# EAGLE design 14140^9 (EAGLE 7.6.0)
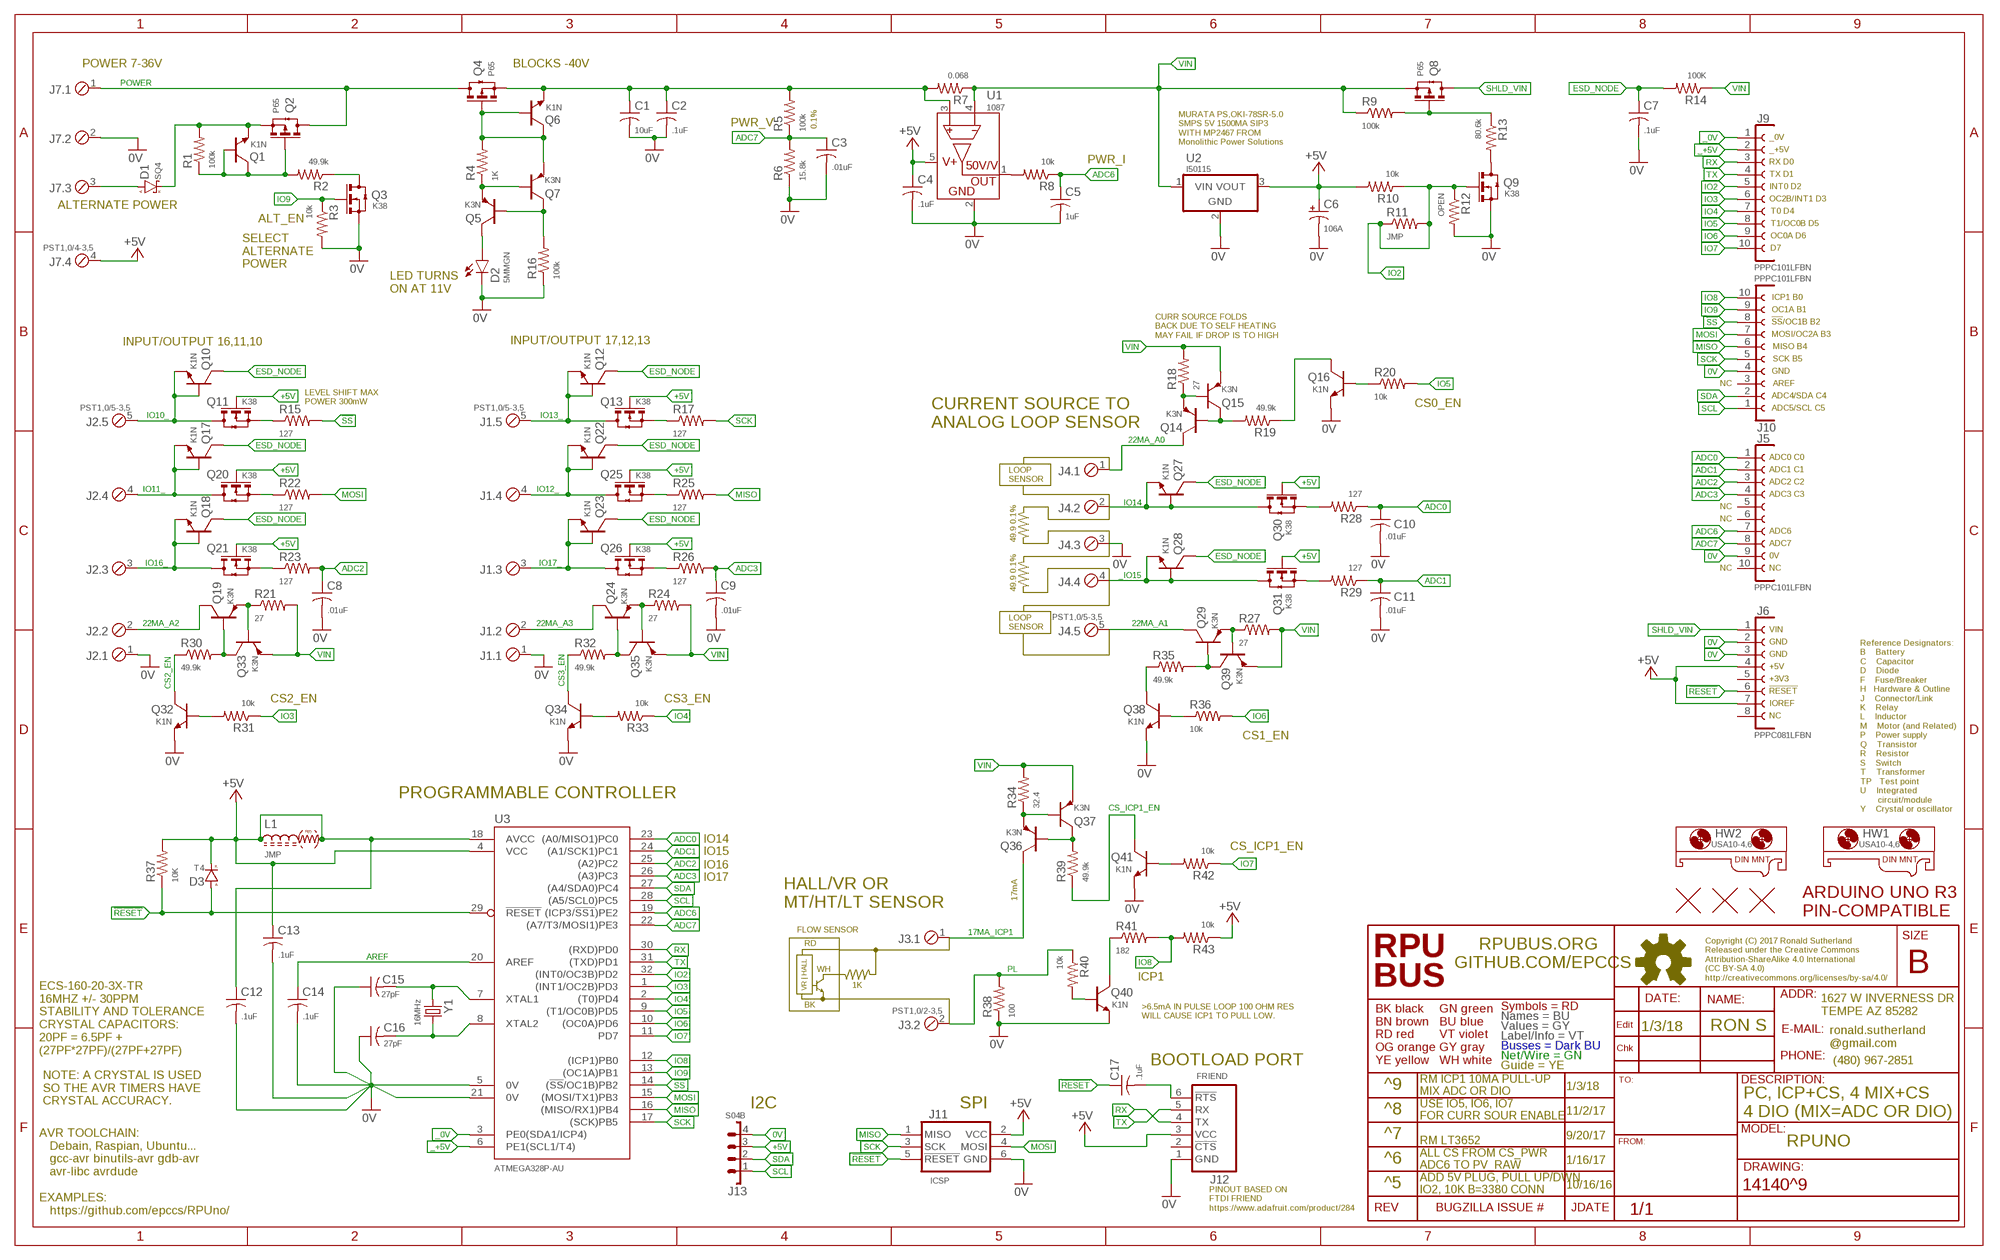
[diagram p0: schematic, sheet 1]

## Parts
C1  10uF  CC1206  [C1206(3216)]
C2  .1uF  CC0805A  [C0805(2012)]
C3  .01uF  CC0603A  [C0603(1608)]
C4  .1uF  CC0603A  [C0603(1608)]
C5  1uF  CC0805A  [C0805(2012)]
C6  106A  CT1206  [3216]
C7  .1uF  CC0603A  [C0603(1608)]
C8  .01uF  CC0603A  [C0603(1608)]
C9  .01uF  CC0603A  [C0603(1608)]
C10  .01uF  CC0603A  [C0603(1608)]
C11  .01uF  CC0603A  [C0603(1608)]
C12  .1uF  CC0603A  [C0603(1608)]
C13  .1uF  CC0603A  [C0603(1608)]
C14  .1uF  CC0603A  [C0603(1608)]
C15  27pF  CC0603A  [C0603(1608)]
C16  27pF  CC0603A  [C0603(1608)]
C17  .1uF  CC0603A  [C0603(1608)]
D1  SQ4  DSMA  [SMA]
D2  5MMGN  LED5MM  [LED5MM]
D3  T4  DSOD123  [SOD123]
HW1  USA10-4,6  MOUNT-HOLE5.0  [USA10]
HW2  USA10-4,6  MOUNT-HOLE5.0  [USA10]
J1  PST1,0/5-3,5  MCV5  [MCV5]
J2  PST1,0/5-3,5  MCV5  [MCV5]
J3  PST1,0/2-3,5  MCV2  [MCV2]
J4  PST1,0/5-3,5  MCV5  [MCV5]
J5  PPPC101LFBN  F1X10  [F1X10]
J6  PPPC081LFBN  F1X8  [F1X8]
J7  PST1,0/4-3,5  MCV4  [MCV4]
J9  PPPC101LFBN  F1X10  [F1X10]
J10  PPPC101LFBN  F1X10  [F1X10]
J11  ICSP  ISP-SPIPTH  [ISP]
J12  FRIEND  [FRIEND]
J13  S04B  B04B  [B04B]
L1  JMP  L0805  [C0805(2012)]
Q1  K1N  NPNSOT23  [SOT23]
Q2  P65  N-CHSOT23  [SOT23]
Q3  K38  N-CHSOT23  [SOT23]
Q4  P65  N-CHSOT23  [SOT23]
Q5  K3N  PNPSOT23  [SOT23]
Q6  K1N  NPNSOT23  [SOT23]
Q7  K3N  PNPSOT23  [SOT23]
Q8  P65  N-CHSOT23  [SOT23]
Q9  K38  N-CHSOT23  [SOT23]
Q10  K1N  NPNSOT23  [SOT23]
Q11  K38  N-CHSOT23  [SOT23]
Q12  K1N  NPNSOT23  [SOT23]
Q13  K38  N-CHSOT23  [SOT23]
Q14  K3N  PNPSOT23  [SOT23]
Q15  K3N  PNPSOT23  [SOT23]
Q16  K1N  NPNSOT23  [SOT23]
Q17  K1N  NPNSOT23  [SOT23]
Q18  K1N  NPNSOT23  [SOT23]
Q19  K3N  PNPSOT23  [SOT23]
Q20  K38  N-CHSOT23  [SOT23]
Q21  K38  N-CHSOT23  [SOT23]
Q22  K1N  NPNSOT23  [SOT23]
Q23  K1N  NPNSOT23  [SOT23]
Q24  K3N  PNPSOT23  [SOT23]
Q25  K38  N-CHSOT23  [SOT23]
Q26  K38  N-CHSOT23  [SOT23]
Q27  K1N  NPNSOT23  [SOT23]
Q28  K1N  NPNSOT23  [SOT23]
Q29  K3N  PNPSOT23  [SOT23]
Q30  K38  N-CHSOT23  [SOT23]
Q31  K38  N-CHSOT23  [SOT23]
Q32  K1N  NPNSOT23  [SOT23]
Q33  K3N  PNPSOT23  [SOT23]
Q34  K1N  NPNSOT23  [SOT23]
Q35  K3N  PNPSOT23  [SOT23]
Q36  K3N  PNPSOT23  [SOT23]
Q37  K3N  PNPSOT23  [SOT23]
Q38  K1N  NPNSOT23  [SOT23]
Q39  K3N  PNPSOT23  [SOT23]
Q40  K1N  NPNSOT23  [SOT23]
Q41  K1N  NPNSOT23  [SOT23]
R1  100k  R0805  [C0805(2012)]
R2  49.9k  R0805  [C0805(2012)]
R3  10k  R0805  [C0805(2012)]
R4  1K  R0805  [C0805(2012)]
R5  100k  R0805  [C0805(2012)]
R6  15.8k  R0805  [C0805(2012)]
R7  0.068  R1210  [C1210(3225)]
R8  10k  R0805  [C0805(2012)]
R9  100k  R0805  [C0805(2012)]
R10  10k  R0805  [C0805(2012)]
R11  JMP  R0805  [C0805(2012)]
R12  OPEN  R0805  [C0805(2012)]
R13  80.6k  R0805  [C0805(2012)]
R14  100K  R0805  [C0805(2012)]
R15  127  R0805  [C0805(2012)]
R16  100k  R0805  [C0805(2012)]
R17  127  R0805  [C0805(2012)]
R18  27  R0805  [C0805(2012)]
R19  49.9k  R0805  [C0805(2012)]
R20  10k  R0805  [C0805(2012)]
R21  27  R0805  [C0805(2012)]
R22  127  R0805  [C0805(2012)]
R23  127  R0805  [C0805(2012)]
R24  27  R0805  [C0805(2012)]
R25  127  R0805  [C0805(2012)]
R26  127  R0805  [C0805(2012)]
R27  27  R0805  [C0805(2012)]
R28  127  R0805  [C0805(2012)]
R29  127  R0805  [C0805(2012)]
R30  49.9k  R0805  [C0805(2012)]
R31  10k  R0805  [C0805(2012)]
R32  49.9k  R0805  [C0805(2012)]
R33  10k  R0805  [C0805(2012)]
R34  32.4  R0805  [C0805(2012)]
R35  49.9k  R0805  [C0805(2012)]
R36  10k  R0805  [C0805(2012)]
R37  10K  R0805  [C0805(2012)]
R38  100  R0805  [C0805(2012)]
R39  49.9k  R0805  [C0805(2012)]
R40  10k  R0805  [C0805(2012)]
R41  182  R0805  [C0805(2012)]
R42  10k  R0805  [C0805(2012)]
R43  10k  R0805  [C0805(2012)]
U1  1087  ZXCT1087  [SOT23-5]
U2  I50115  OKI-78SR-H  [OKI-78SR-H]
U3  ATMEGA328P-AU  ATMEGA328PB-AU  [TQFP32-08]
U$1  ARDUINO-UNO  [ARDUINO_UNO]
U$2  FIDUCIAL1.27  [FIDUCIAL-1.27]
U$3  FIDUCIAL1.27  [FIDUCIAL-1.27]
U$4  FIDUCIAL1.27  [FIDUCIAL-1.27]
Y1  16MHz  CSM-3X  [CSM-3X]

## Nets
0V: C1.2 C2.2 C3.2 C4.2 C5.2 C6.- C7.2 C8.2 C9.2 C10.2 C11.2 C12.2 C13.2 C14.2 C15.1 C16.1 D2.K J1.1 J2.1 J4.3 J5.9 J6.2 J6.3 J7.2 J10.4 J11.6(GND) J12.1(GND) J13.4 Q3.2(S)(S) Q9.2(S)(S) Q16.E Q32.E Q34.E Q38.E Q40.E Q41.E R3.2 R6.1 R12.2 R16.1 R38.1 U1.2(GND) U2.2(GND) U3.5(0V) U3.21(0V)
17MA_ICP1: J3.1 Q36.C
22MA_A0: J4.1 Q14.C
22MA_A1: J4.5 Q29.C
22MA_A2: J2.2 Q19.C
22MA_A3: J1.2 Q24.C
!RESET!: C17.1 D3.A J6.6 J11.5(!RESET) R37.1 U3.29(!RESET)
!SS: J10.8 R15.2 U3.14((!SS!/OC1B)PB2)
+5V: C4.1 C6.+ C12.1 C13.1 D3.C(K) J6.4 J6.7 J7.4 J11.2(VCC) J12.3(VCC) J13.3 L1.1 L1.2 Q11.1(G)(G) Q13.1(G)(G) Q20.1(G)(G) Q21.1(G)(G) Q25.1(G)(G) Q26.1(G)(G) Q30.1(G)(G) Q31.1(G)(G) R10.2 R37.2 R43.1 U1.5(VCC) U2.3(VOUT) U3.4(VCC) U3.18(AVCC)
_0V: J9.1 U3.3(PE0(SDA1/ICP4))
_+5V: J9.2 U3.6(PE1(SCL1/T4))
_IO14: J4.2 Q27.B Q27.E Q30.3(D)(D)
_IO15: J4.4 Q28.B Q28.E Q31.3(D)(D)
ADC0: C10.1 J5.1 R28.1 U3.23((A0/MISO1)PC0)
ADC1: C11.1 J5.2 R29.1 U3.24((A1/SCK1)PC1)
ADC2: C8.1 J5.3 R23.2 U3.25((A2)PC2)
ADC3: C9.1 J5.4 R26.2 U3.26((A3)PC3)
ADC6: C5.1 J5.7 R8.1 U3.19((ICP3/!SS1!)PE2)
ADC7: C3.1 J5.8 R5.1 R6.2 U3.22((A7/T3/MOSI1)PE3)
AREF: C14.1 U3.20(AREF)
CS2_EN: Q32.C R30.1
CS3_EN: Q34.C R32.1
CS_ICP1_EN: Q41.C R39.1
ESD_NODE: C7.1 Q10.C Q12.C Q17.C Q18.C Q22.C Q23.C Q27.C Q28.C R14.2
IO2: J9.5 Q9.1(G)(G) R10.1 R11.1 R11.2 R12.1 U3.32((INT0/OC3B)PD2)
IO3: J9.6 R31.1 U3.1((INT1/OC2B)PD3)
IO4: J9.7 R33.1 U3.2((T0)PD4)
IO5: J9.8 R20.2 U3.9((T1/OC0B)PD5)
IO6: J9.9 R36.2 U3.10((OC0A)PD6)
IO7: J9.10 R42.1 U3.11(PD7)
IO8: J10.10 R41.2 R43.2 U3.12((ICP1)PB0)
IO9: J10.9 Q3.1(G)(G) R3.1 U3.13((OC1A)PB1)
IO10_: J2.5 Q10.B Q10.E Q11.3(D)(D)
IO11_: J2.4 Q17.B Q17.E Q20.3(D)(D)
IO12_: J1.4 Q22.B Q22.E Q25.3(D)(D)
IO13_: J1.5 Q12.B Q12.E Q13.3(D)(D)
IO16_: J2.3 Q18.B Q18.E Q21.3(D)(D)
IO17_: J1.3 Q23.B Q23.E Q26.3(D)(D)
MISO: J10.6 J11.1(MISO) R25.2 U3.16((MISO/RX1)PB4)
MOSI: J10.7 J11.4(MOSI) R22.2 U3.15((MOSI/TX1)PB3)
N$1: Q25.2(S)(S) R25.1
N$2: Q8.1(G)(G) R9.2 R13.1
N$3: Q13.2(S)(S) R17.1
N$4: Q9.3(D)(D) R13.2
N$5: Q5.B Q7.C R16.2
N$6: Q4.1(G)(G) Q6.B Q6.C Q7.E R4.2
N$7: D2.A Q5.C
N$8: R8.2 U1.1(OUT)
N$9: Q24.E Q35.B R24.1
N$10: Q5.E Q7.B R4.1
N$11: Q24.B Q35.C R32.2
N$12: Q26.2(S)(S) R26.1
N$13: D1.A J7.3
N$15: Q31.2(S)(S) R29.2
N$16: Q30.2(S)(S) R28.2
N$18: Q41.B R42.2
N$19: Q38.C R35.1
N$20: Q14.E Q15.B R18.1
N$21: Q16.C R19.1
N$22: Q16.B R20.1
N$23: Q14.B Q15.C R19.2
N$25: Q38.B R36.1
N$26: Q32.B R31.2
N$28: Q29.E Q39.B R27.1
N$29: Q29.B Q39.C R35.2
N$30: Q34.B R33.2
N$32: D1.K Q1.E Q2.2(S)(S) R1.2
N$33: Q1.B Q1.C Q2.1(G)(G) R1.1 R2.2
N$34: Q3.3(D)(D) R2.1
N$35: C17.2 J12.6(!RTS)
N$91: Q19.E Q33.B R21.1
N$93: Q20.2(S)(S) R22.1
N$97: Q19.B Q33.C R30.2
N$104: Q11.2(S)(S) R15.1
N$107: Q40.B R40.2
N$108: Q40.C R41.1
N$110: Q21.2(S)(S) R23.1
N$114: Q36.E Q37.B R34.1
N$115: C15.2 U3.7(XTAL1) Y1.1
N$116: C16.2 U3.8(XTAL2) Y1.2
N$119: Q36.B Q37.C R39.2
PL: J3.2 R38.2 R40.1
POWER: J7.1 Q2.3(D)(D) Q4.3(D)(D)
RX: J9.3 J12.4(TX) U3.30((RXD)PD0)
SCK: J10.5 J11.3(SCK) R17.2 U3.17((SCK)PB5)
SCL: J10.1 J13.1 U3.28((A5/SCL0)PC5)
SDA: J10.2 J13.2 U3.27((A4/SDA0)PC4)
SHLD_VIN: J6.1 Q8.3(D)(D)
TX: J9.4 J12.5(RX) U3.31((TXD)PD1)
VIN: Q8.2(S)(S) Q15.E Q33.E Q35.E Q37.E Q39.E R7.1 R9.1 R14.1 R18.2 R21.2 R24.2 R27.2 R34.2 U1.4(S-) U2.1(VIN)
VIN_S: C1.1 C2.1 Q4.2(S)(S) Q6.E R5.2 R7.2 U1.3(S+)
Unconnected: J5.5 J5.6 J5.10 J6.5 J6.8 J10.3 J12.2(!CTS)

## Notes on the sheet
- POWER 7-36V | BLOCKS -40V
- PWR_V
- 0.1%
- _0V
- MURATA PS,OKI-78SR-5.0
  SMPS 5V 1500MA SIP3
  WITH MP2467 FROM 
  Monolithic Power Solutions
- _+5V
- PWR_I | RX D0
- TX D1
- INT0 D2
- OC2B/INT1 D3
- ALTERNATE POWER
- T0 D4
- ALT_EN
- T1/OC0B D5
- OC0A D6
- D7
- SELECT
  ALTERNATE
  POWER
- LED TURNS 
  ON AT 11V
- ICP1 B0
- OC1A B1
- !SS!/OC1B B2
- MOSI/OC2A B3
- CURR SOURCE FOLDS 
  BACK DUE TO SELF HEATING 
  MAY FAIL IF DROP IS TO HIGH
- INPUT/OUTPUT 16,11,10 | INPUT/OUTPUT 17,12,13
- MISO B4
- SCK B5
- GND
- NC | AREF
- ADC4/SDA C4
- LEVEL SHIFT MAX 
  POWER 300mW
- CS0_EN
- ADC5/SCL C5
- CURRENT SOURCE TO
  ANALOG LOOP SENSOR
- ADC0 C0
- ADC1 C1
- LOOP 
  SENSOR
- ADC2 C2
- ADC3 C3
- NC
- NC
- ADC6
- 49.9 0.1%
- ADC7
- 0V
- NC | NC
- 49.9 0.1%
- LOOP 
  SENSOR
- VIN
- GND
- GND
- +5V
- +3V3
- !RESET
- CS2_EN | CS3_EN
- IOREF
- NC
- CS1_EN
- PROGRAMMABLE CONTROLLER
- IO14
- CS_ICP1_EN
- IO15
- IO16
- IO17
- 17mA
- HALL/VR OR
  MT/HT/LT SENSOR
- FLOW SENSOR
- RD
- WH
- 1K | ICP1
- VR | HALL
- BK
- >6.5mA IN PULSE LOOP 100 OHM RES
  WILL CAUSE ICP1 TO PULL LOW.
- 1/3/18 | RON S
- ECS-160-20-3X-TR
  16MHZ +/- 30PPM
  STABILITY AND TOLERANCE
  CRYSTAL CAPACITORS:
  20PF = 6.5PF +
  (27PF*27PF)/(27PF+27PF)
- BOOTLOAD PORT
- ^9 | 1/3/18
- RM ICP1 10MA PULL-UP 
  MIX ADC OR DIO
- NOTE: A CRYSTAL IS USED 
  SO THE AVR TIMERS HAVE 
  CRYSTAL ACCURACY.
- I2C | SPI
- ^8 | 11/2/17
- PC, ICP+CS, 4 MIX+CS
  4 DIO (MIX=ADC OR DIO)
- USE IO5, IO6, IO7
  FOR CURR SOUR ENABLE
- ^7 | 9/20/17
- RM LT3652 | RPUNO
- ^6 | 1/16/17
- ALL CS FROM CS_PWR
  ADC6 TO PV_RAW
- ^5 | 10/16/16
- ADD 5V PLUG, PULL UP/DWN 
  IO2, 10K B=3380 CONN
- PINOUT BASED ON
  FTDI FRIEND
  https://www.adafruit.com/product/284
- AVR TOOLCHAIN: 
     Debain, Raspian, Ubuntu...
     gcc-avr binutils-avr gdb-avr 
     avr-libc avrdude
  
  EXAMPLES:
     https://github.com/epccs/RPUno/

## Library data of the parts
C1-C5 C7-C17 = C-C:C: CAPACITOR Symbol
C6 = C-T:CT: Tantalum Electrolytic Capacitor
D1 = D-SBR:D: DIODE
D2 = D-LED:LED: LED 120120WH [CREE,XHGAWT-00-0000-00000HXE1] LED WHITE 6500K 150LUM-W120120
D3 = D-GP:D: DIODE
HW1 HW2 = HW-DINMnt:MOUNT-HOLE: USA10-4.6 [PhxCont,1202713] DINRAIL ADAPTER UNIVERSAL 10MM 4.6MM
J1 J2 J4 = J-HDR3.5mm:MCV5: MCV 1,5/5-G-3,5-RN [PHOENIX CONTACT,1843635] CONN HEADER SHROUDED 5POS 3.5MM MCVR 1,5/5-ST-3,5 [PHOENIX CONTACT,1863181] CONN PLUG 5POS SCREW 3.5MM PST 1,0/5-3,5 [PHOENIX CONTACT,1945122] CONN HEADER STRIP PIN 5POS 3.5MM PT 1,5/5-PVH-3,5 [PHOENIX CONTACT,1984044] CONN PLUG STRIP 4POS 3.5MM Drill Size 3/64": .0469" (1.2mm)
J3 = J-HDR3.5mm:MCV2: MCV 1,5/ 2-G-3,5-RN [PHOENIX CONTACT,1731471] CONN HEADER SHROUDED 2POS 3.5MM MCVR 1,5/ 2-ST-3,5 [PHOENIX CONTACT,1863152] CONN PLUG 2POS SCREW 3.5MM PST 1,0/2-3,5 [PHOENIX CONTACT,1945096] CONN HEADER STRIP PIN 2POS 3.5MM PT1,5/2-PVH-3,5 [PHOENIX CONTACT,1984015] CONN PLUG STRIP 2POS 3.5MM
J5 J9 J10 = J-HDR2.54mm:F1X10: FEMALE HEADER 10POS
J6 = J-HDR2.54mm:F1X8: FEMALE HEADER 8POS
J7 = J-HDR3.5mm:MCV4: MCV 1,5/4-G-3,5-RN [PHOENIX CONTACT,1843622] CONN HEADER SHROUDED 2POS 3.5MM PST 1,0/4-3,5 [PHOENIX CONTACT,1945119] CONN HEADER STRIP PIN 4POS 3.5MM MCVR 1,5& 4-ST-3,5 [PHOENIX CONTACT,1863178] CONN PLUG 4POS SCREW 3.5MM
J11 = U-AVR:ISP-SPI: AVR ISP thru SPI In-System Programming uses the target Atmel AVR’s internal SPI (Serial Peripheral Interface) to download code into the flash and EEPROM memories. It is not a debugging interface. When designing an application PCB which includes an AVR with the SPI interface, this pinout should be used. Sparkfun SKU: BOB-08508
J12 = U-AVR:FRIEND: used for serial interfaces and serial bootloaders optiboot does not read the fuse but reports as they should be. It also erases chip. avrdude -c arduino -v -p atmega328p -P /dev/ttyUSB0 -b 115200 -U flash:w:BlinkLED.hex xboot use -e to erase chip, and -u to disable fuse checks since bootloaders can't see them. avrdude -c avr109 -v -p atmega1284p -P /dev/ttyUSB0 -b 115200 -e -u -U flash:w:BlinkLED.hex Arduino uses the nRTS (or nDTR) negative going edge to start the bootloader by causing a reset on the MCU.
J13 = J-HDR2mm:B04B: B04B [JST@B04B-PASK] CONN HEADER VERT THRU 4POS S04B [JST@S04B-PASK] CONN HEADER SIDE THRU 4POS
L1 = L-FB:L: Ferrite Bead with frequency dependent resistance
Q1 Q6 Q10 Q12 Q16-Q18 Q22 Q23 Q27 Q28 Q32 Q34 Q38 Q40 Q41 = Q-NPN:NPN: BJT NPN General Purpose Amplifier
Q2 Q4 Q8 = Q-PCH:N-CH?*: ENHANCEMENT MODE MOSFET SOT23 is BSS138 pinout
Q3 Q9 Q11 Q13 Q20 Q21 Q25 Q26 Q30 Q31 = Q-NCH:N-CH?*: ENHANCEMENT MODE MOSFET SOT23 is BSS138 pinout
Q5 Q7 Q14 Q15 Q19 Q24 Q29 Q33 Q35-Q37 Q39 = Q-PNP:PNP: BJT NPN General Purpose Amplifier
R1-R43 = R-C:R: Resiistor American-style symbol
U1 = U-Linear:ZXCT1087: 1087 [DIODES,ZXCT1087E5TA] HISIDE CURRENT MONITOR SOT23-5
U2 = P-DCDC:OKI-78SR: OKI-78SR OKI-78SR-5/1.5-W36H-C 5V@1.5A Horizontal Mount OKI-78SR-5/1.5-W36-C 5V@1.5A Vert Mount OKI-78SR-3.3/1.5-W36H-C 3.3V@1.5A Horizontal Mount OKI-78SR-3.3/1.5-W36-C 3.3V@1.5A Vert Mount Murata Power Solutions 7 to 36 VDC input range need to verify pinout
U3 = U-AVR:ATMEGA328PB-AU: ATmega328PB 4 Kbytes FLASH 128 bytes SRAM 256 bytes EEPROM 2 UART, 2 I2C, 2 SPI 8-channel 10 bit ADC
U$1 = J-BoardHDR:ARDUINO-UNO: Board Outline with holes and silk note the board dim layer is not defined
U$2-U$4 = H-Fiducial:FIDUCIAL: Fiducial Alignment Points Various fiducial points for machine vision alignment.
Y1 = Y-XTL:CSM: 16MHZ20 [ECS,ECS-160-20-3X-TR] CRYSTAL 16MHZ 20PF 30PPM CSM-3X

## Net classes
0 default: width 0.178 mm, drill 0.33 mm

## Board
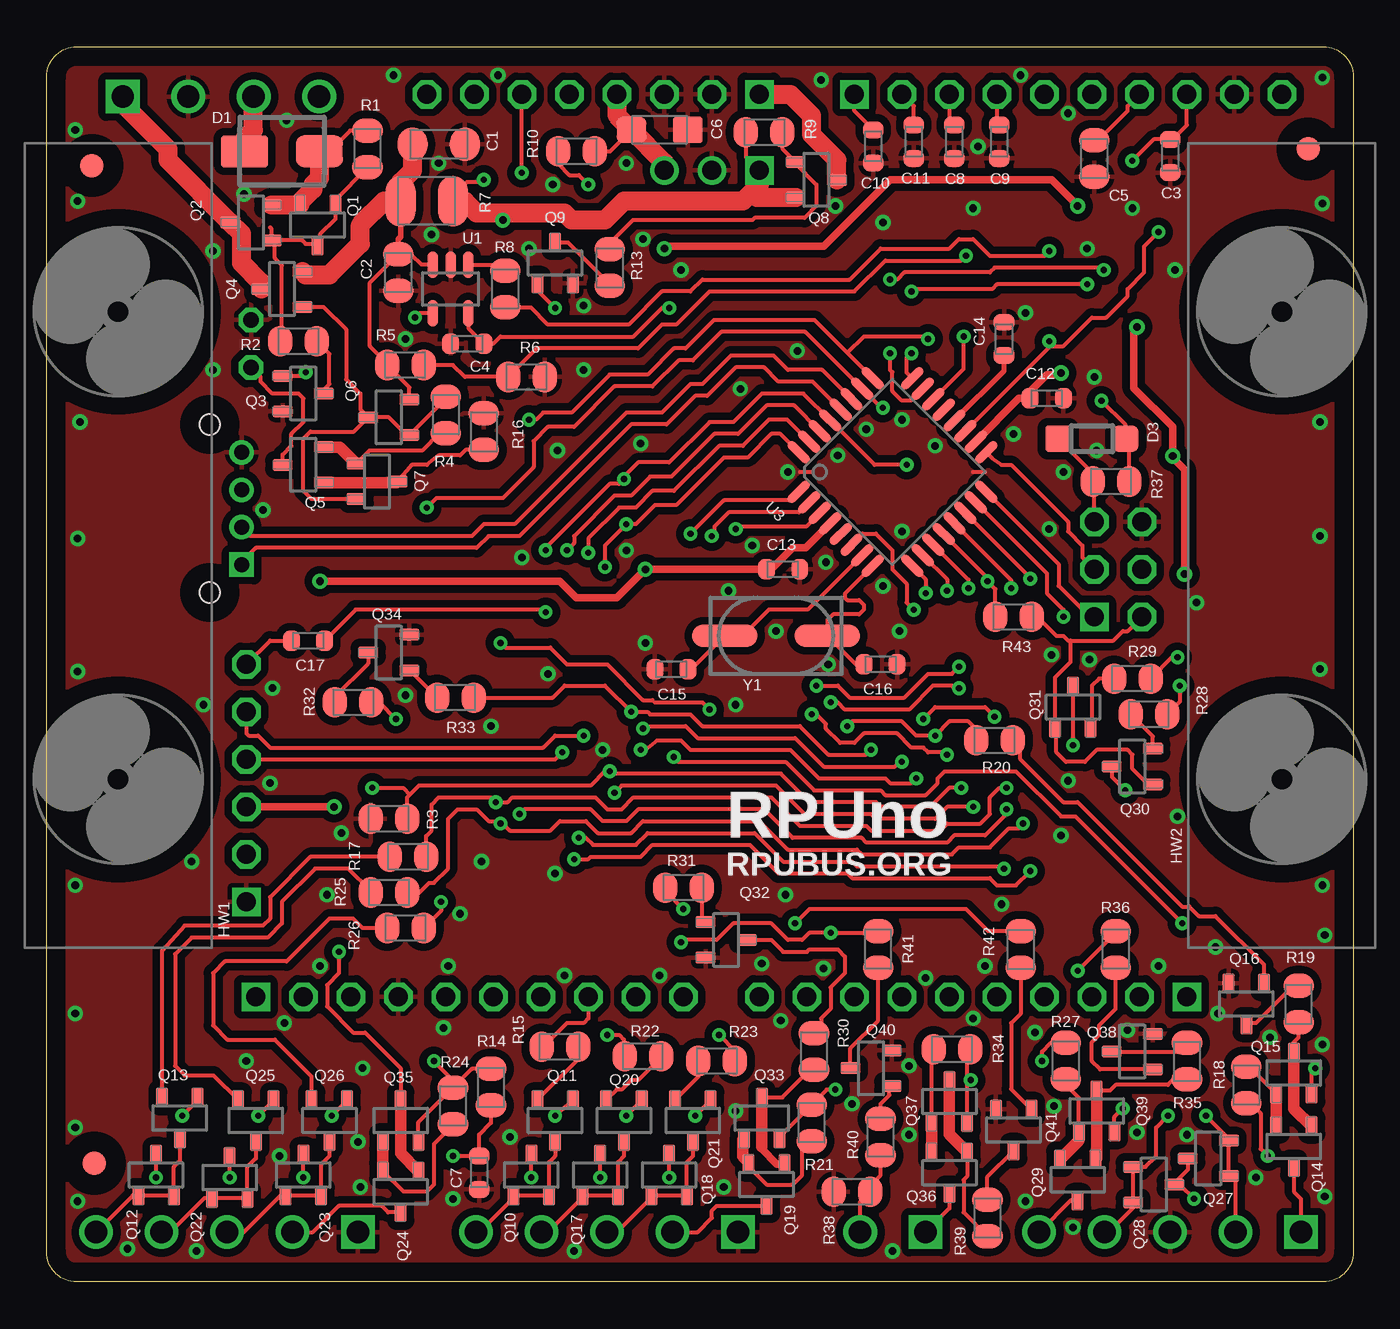
[diagram p1: board, top side]
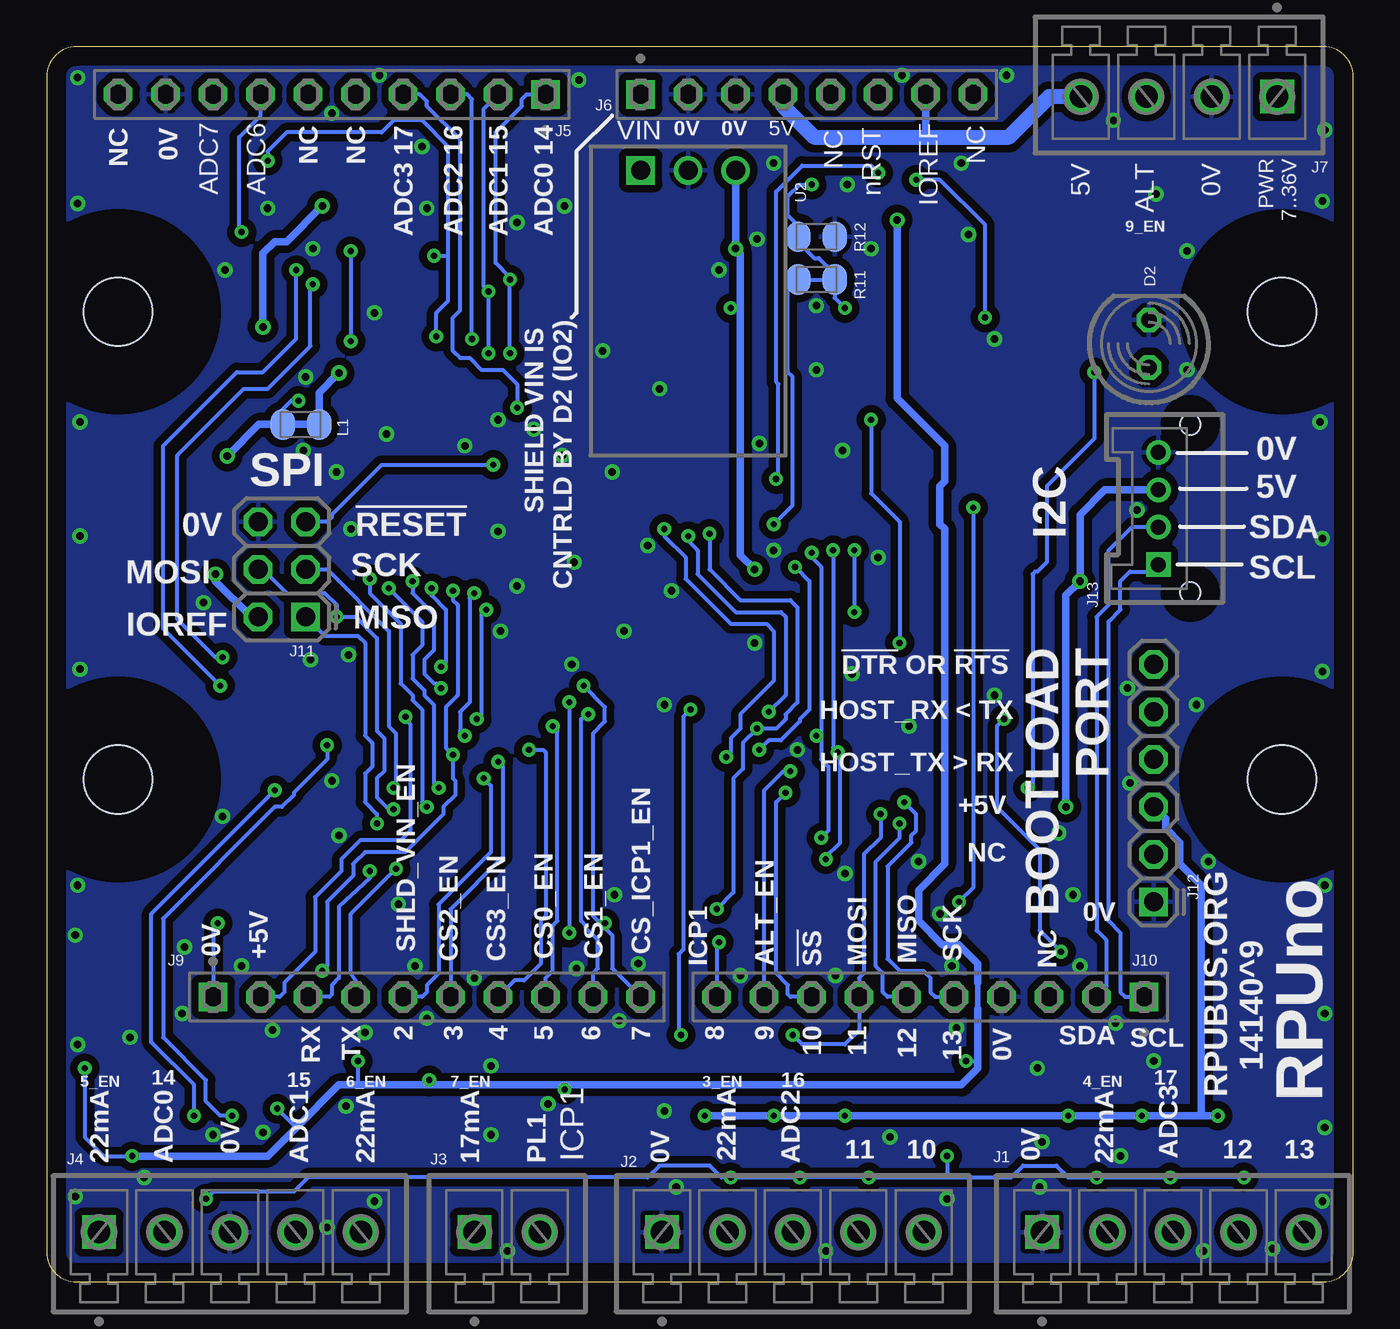
[diagram p2: board, bottom side, seen from below]

Size 69.85 x 66.04 mm. Coordinates in mm from the lower left corner, seen from the top.
Outline: 69.85,64.45 69.85,1.59 arc-90 68.26,0 1.59,0 arc-90 0,1.59 0,64.45 arc-90 1.59,66.04 68.26,66.04 arc-90 69.85,64.45
Copper layers (1*16): Top 0.034290625mm / dielectric 60mil / Bottom 0.034290625mm
Design rules "default *": minimum track width 7mil, minimum drill 13mil, track to track 12mil, track to pad 10mil, pad to pad 8mil, via to via 12mil, smd to smd 8mil, copper to edge 40mil, drill to drill 16mil, minimum pad ring 10mil, minimum via ring 8mil, stop-mask expansion 4mil, vias tented up to drill 17mil, thermal gap 10mil

### Footprints (pad centres in the part's own frame; a part is rotated, then mirrored left to right if it is on the bottom)
C1206(3216) = smd 1.6 x 1.8: 1 -1.4,0; 2 1.4,0
C0805(2012) = smd 1.321 x 1.651: 1 -0.977,0; 2 0.977,0
C0603(1608) = smd 0.898 x 1.1: 1 -0.889,0; 2 0.889,0
3216 = smd 1.6 x 1.4: + -1.5,0; - 1.5,0
SMA = smd 2.5 x 1.7: A 2,0; K -2,0
LED5MM = drill 0.813 octagon: A -1.27,0; K 1.27,0
SOD123 = smd 1.4 x 1.4: A 1.8,0; C -1.8,0
USA10 = hole 3.658: -12.5,0; 12.5,0
MCV5 = drill 1.2 square: 1 0,0 | drill 1.2: 2 3.5,0; 3 7,0; 4 10.5,0; 5 14,0
MCV2 = drill 1.2 square: 1 0,0 | drill 1.2: 2 3.5,0
F1X10 = drill 1.016 square: 1 0,0 | drill 1.016 octagon: 2 2.54,0; 3 5.08,0; 4 7.62,0; 5 10.16,0; 6 12.7,0; 7 15.24,0; 8 17.78,0; 9 20.32,0; 10 22.86,0
F1X8 = drill 1.016 square: 1 0,0 | drill 1.016 octagon: 2 2.54,0; 3 5.08,0; 4 7.62,0; 5 10.16,0; 6 12.7,0; 7 15.24,0; 8 17.78,0
MCV4 = drill 1.2 square: 1 0,0 | drill 1.2: 2 3.5,0; 3 7,0; 4 10.5,0
ISP = drill 1.016 square: 1 0,0 | drill 1.016 octagon: 2 0,2.54; 3 2.54,0; 4 2.54,2.54; 5 5.08,0; 6 5.08,2.54
FRIEND = drill 1.016 square: 1 0,0 | drill 1.016 octagon: 2 2.54,0; 3 5.08,0; 4 7.62,0; 5 10.16,0; 6 12.7,0
B04B = drill 0.8 square: 1 0,0 | drill 0.8: 2 2,0; 3 4,0; 4 6,0 | hole 1.1: 7.5,-1.7; -1.5,-1.7
SOT23 = smd 0.65 x 1.06: B -0.95,-1.1; C 0,1.1; E 0.95,-1.1
SOT23' = smd 0.65 x 1.06: 1(G) -0.95,-1.1; 2(S) 0.95,-1.1; 3(D) 0,1.1
C1210(3225) = smd 1.6 x 2.7: 1 -1.4,0; 2 1.4,0
SOT23-5 = smd 0.55 x 1.4: 1 -0.95,-1.3; 2 0,-1.3; 3 0.95,-1.3; 4 0.95,1.3; 5 -0.95,1.3
OKI-78SR-H = drill 1.016 square: 1 0,0 | drill 1.016: 2 -2.54,0; 3 -5.08,0
TQFP32-08 = smd 1.5 x 0.45: 1 -4.293,2.8; 2 -4.293,2; 3 -4.293,1.2; 4 -4.293,0.4; 5 -4.293,-0.4; 6 -4.293,-1.2; 7 -4.293,-2; 8 -4.293,-2.8; 17 4.293,-2.8; 18 4.293,-2; 19 4.293,-1.2; 20 4.293,-0.4; 21 4.293,0.4; 22 4.293,1.2; 23 4.293,2; 24 4.293,2.8 | smd 0.45 x 1.5: 9 -2.8,-4.293; 10 -2,-4.293; 11 -1.2,-4.293; 12 -0.4,-4.293; 13 0.4,-4.293; 14 1.2,-4.293; 15 2,-4.293; 16 2.8,-4.293; 25 2.8,4.293; 26 2,4.293; 27 1.2,4.293; 28 0.4,4.293; 29 -0.4,4.293; 30 -1.2,4.293; 31 -2,4.293; 32 -2.8,4.293
FIDUCIAL-1.27 = smd 1.27 x 1.27: 1 0,0
CSM-3X = smd 3.5 x 1.2: 1 -2.75,0; 2 2.75,0

### Placement (x,y rotation side)
C1  20.96,60.83 0 top
C2  18.8,53.98 270 top
C3  60.07,60.2 270 top
C4  22.48,50.16 180 top
C5  56.01,60.07 270 top
C6  32.77,61.59 0 top
C7  23.11,5.84 270 top
C8  48.51,60.96 270 top
C9  50.93,60.96 270 top
C10  44.2,60.71 270 top
C11  46.35,60.96 270 top
C12  53.47,47.24 0 top
C13  39.37,38.1 0 top
C14  51.18,50.42 90 top
C15  33.4,32.77 0 top
C16  44.58,33.02 180 top
C17  13.97,34.29 180 top
D1  12.57,60.45 180 top
D2  10.92,50.16 90 bottom
D3  55.88,45.09 180 top
HW1  3.81,39.37 90 top
HW2  66.04,39.37 90 top
J1  16.64,2.67 0 bottom
J2  36.96,2.67 0 bottom
J3  46.99,2.67 0 bottom
J4  67.06,2.67 0 bottom
J5  43.18,63.5 180 bottom
J6  38.1,63.5 0 bottom
J7  4.06,63.37 180 bottom
J9  60.96,15.24 0 bottom
J10  11.18,15.24 180 bottom
J11  56.01,35.56 90 bottom
J12  10.67,20.32 90 bottom
J13  10.41,38.35 90 bottom
L1  56.26,45.85 180 bottom
Q1  14.48,56.52 180 top
Q2  P65  [SOT23']  10.92,56.64 90 top
Q3  K38  [SOT23']  13.72,47.5 270 top
Q4  P65  [SOT23']  12.57,53.09 90 top
Q5  13.72,43.69 90 top
Q6  18.29,46.23 90 top
Q7  17.65,42.8 270 top
Q8  P65  [SOT23']  41.15,58.93 270 top
Q9  K38  [SOT23']  27.18,54.48 0 top
Q10  25.91,5.71 0 top
Q11  K38  [SOT23']  27.18,8.64 180 top
Q12  5.84,5.71 0 top
Q13  K38  [SOT23']  7.11,8.76 180 top
Q14  66.67,7.24 180 top
Q15  66.67,11.18 0 top
Q16  64.13,14.86 180 top
Q17  29.59,5.71 0 top
Q18  33.27,5.71 0 top
Q19  38.48,5.21 180 top
Q20  K38  [SOT23']  30.86,8.64 180 top
Q21  K38  [SOT23']  34.54,8.64 180 top
Q22  9.78,5.59 0 top
Q23  13.72,5.71 0 top
Q24  18.92,4.83 180 top
Q25  K38  [SOT23']  11.18,8.64 180 top
Q26  K38  [SOT23']  15.11,8.64 180 top
Q27  62.1,6.6 90 top
Q28  59.18,5.21 270 top
Q29  55.12,5.46 180 top
Q30  K38  [SOT23']  58.04,27.56 90 top
Q31  K38  [SOT23']  54.86,30.73 0 top
Q32  36.32,18.29 270 top
Q33  38.23,8.76 0 top
Q34  18.29,33.66 90 top
Q35  18.92,8.64 0 top
Q36  48.26,5.84 180 top
Q37  48.26,9.65 0 top
Q38  58.04,12.32 90 top
Q39  56.13,9.14 0 top
Q40  44.07,11.43 90 top
Q41  51.69,8.13 180 top
R1  17.14,60.58 90 top
R2  13.46,50.29 180 top
R3  18.29,24.77 180 top
R4  21.34,46.35 90 top
R5  19.18,49.02 180 top
R6  25.65,48.39 180 top
R7  20.32,57.78 180 top
R8  24.51,53.09 90 top
R9  38.35,61.47 0 top
R10  28.32,60.45 0 top
R11  28.7,53.59 0 bottom
R12  28.7,55.88 0 bottom
R13  30.1,54.23 270 top
R14  23.75,10.41 270 top
R15  27.43,12.57 180 top
R16  23.37,45.47 270 top
R17  19.3,22.73 0 top
R18  64.13,10.54 270 top
R19  66.93,14.86 270 top
R20  50.67,28.96 180 top
R21  40.89,8.51 90 top
R22  31.88,12.06 180 top
R23  35.81,11.81 0 top
R24  21.72,9.4 90 top
R25  18.29,20.83 0 top
R26  19.18,18.92 0 top
R27  54.48,11.81 90 top
R28  58.93,30.35 180 top
R29  58.04,32.26 180 top
R30  41.02,12.32 270 top
R31  34.04,21.08 0 top
R32  16.38,30.99 0 top
R33  21.84,31.24 180 top
R34  48.39,12.45 0 top
R35  60.96,11.81 270 top
R36  57.15,17.78 90 top
R37  56.9,42.8 0 top
R38  43.05,4.83 0 top
R39  50.29,3.43 270 top
R40  44.58,7.75 90 top
R41  44.45,17.78 90 top
R42  52.07,17.78 270 top
R43  51.69,35.56 180 top
U1  21.59,53.09 180 top
U2  38.1,59.44 180 bottom
U3  45.21,43.31 45 top
U$1  -7.62,66.04 180 bottom  (outside the outline)
U$2  67.44,60.58 0 top
U$3  2.41,59.69 0 top
U$4  2.54,6.35 0 top
Y1  38.99,34.54 0 top

### Tracks (layer width: path | path; a pad name or v marks a point on that pad's centre or on a via)
0V  (via drill 0.41)
  Top 0.203: 40.26,43.31 40.89,43.31 | 49.53,43.31 50.16,43.31
  other vias: 62.61,14.35 46.99,16.26 56.01,48.39 52.32,51.82 27.69,16.38 18.54,64.52 28.7,52.2 24.13,64.52 44.7,56.64 60.33,54.1 14.6,16.89 49.53,57.4 55.63,55.24 33.91,54.1 42.16,57.53 41.4,64.26 31.88,55.75 58.04,57.4 54.61,62.48 52.07,64.52 68.2,64.39 68.2,57.66 68.07,45.97 68.07,39.88 68.07,32.77 60.45,24.89 68.2,21.21 68.33,18.54 62.48,17.91 59.44,16.89 30.99,59.82 27.05,58.67 25.78,55.24 41.66,38.48 37.72,39.37 19.18,50.42 28.7,48.77 1.65,57.78 1.52,61.59 8.89,55.12 8.89,48.77 1.78,45.97 1.65,39.75 1.65,32.64 8.38,30.86 7.75,22.48 1.52,21.21 54.23,23.88 54.61,26.8 61.47,36.32 53.59,40.26 56.13,44.45 51.69,45.34 36.45,36.96 47.5,44.7 40.13,49.78 11.56,41.27 30.99,39.12 39.62,43.31 32.77,16.38 68.33,4.57 64.64,5.59 65.41,13.08 58.29,8 54.86,2.92 52.32,4.32 45.21,1.65 46.1,7.87 46.1,11.56 1.65,4.32 8,1.65 4.32,1.78 1.52,14.35 1.52,8.26 43.05,9.53 51.05,20.19 26.8,32.51 49.53,14.1 28.19,1.65 49.78,60.71 45.72,46.1 43.81,45.59 42.29,44.2 45.72,40.13 20.57,56.01 20.96,59.82 12.83,62.1 10.54,58.17 37.08,47.75 27.3,44.45 31.75,44.83 25.4,38.73 44.7,37.21 38.99,34.8 45.59,34.8 32,34.16 54.36,43.31 55.75,33.27 50.16,16.89 39.5,20.7 38.23,17.02 39.24,13.97 36.83,9.14 36.2,5.08 53.85,9.4 52.83,13.34 57.78,13.46 60.96,7.87 68.2,12.7 41.53,16.76 21.46,16.89 29.72,28.45 14.99,20.7 10.67,11.81 16.89,11.43 16.76,5.08 23.75,29.72 19.18,31.37 12.06,31.75 11.94,26.67 15.75,24 12.7,13.84 12.45,6.73 21.72,4.45 16.64,7.49 22.1,19.68 23.24,22.48 27.18,21.84 21.21,13.59 24.77,7.75 36.83,30.86 41.78,33.02 53.72,33.53
  pour Bottom (isolate 0.406): 0,66.04 69.85,66.04 69.85,0 0,0
  pour Top (isolate 0.406, rank 6): 0,66.04 69.85,66.04 69.85,0 0,0
17MA_ICP1
  Top 0.203: Q36.C 48.26,3.94 J3.1
22MA_A0
  Top 0.203: Q14.C 66.67,4.83 67.06,4.45 J4.1
22MA_A1
  Top 0.203: Q29.C 54.75,4.36 J4.5
22MA_A2
  Top 0.203: J2.2 34.8,2.67 35.56,3.43 35.56,3.81 35.81,4.06 38.44,4.06 Q19.C
22MA_A3
  Top 0.203: Q24.C 18.25,3.73 17.91,4.06 15.62,4.06 14.22,2.67 J1.2
!RESET!  (via drill 0.33)
  Top 0.203: v45.97,43.69 44.27,43.69 U3.29 40.45,47.5 38.23,47.5 36.7,45.97 35.43,45.97 33.27,43.81 31.62,43.81 30.86,43.05 v30.86,42.93 30.61,42.67 30.1,42.67 26.67,39.24 v26.67,39.12 | v25.4,59.31 J6.6 | J11.5 56.01,42.84 R37.1 55.92,43.25 D3.A | v26.67,35.81 26.54,35.94 16.51,35.94 C17.1
  Bottom 0.203: v45.97,43.69 51.94,43.69 54.61,41.02 54.61,40.89 54.86,40.64 J11.5 | v30.86,42.93 30.73,43.05 30.73,48.01 30.86,48.13 30.86,58.29 29.46,59.69 25.78,59.69 v25.4,59.31 | v26.67,39.12 v26.67,35.81
!SS  (via drill 0.33)
  Top 0.203: U3.14 52.58,37.64 v52.58,37.59 | v49.53,25.4 48.13,25.4 47.5,24.77 44.32,24.77 44.07,25.02 40.51,25.02 38.99,26.54 30.73,26.54 v30.35,26.16 | J10.8 28.96,14.1 28.7,13.84 27.81,13.84 26.92,12.95 26.67,12.66 R15.2
  Bottom 0.203: v52.58,37.59 52.58,36.83 50.93,35.18 50.93,32 50.29,31.37 50.29,31.11 49.78,30.61 49.78,25.65 v49.53,25.4 | J10.8 30.1,15.24 30.23,15.37 30.23,15.88 30.86,16.51 30.86,25.65 v30.35,26.16
+5V  (via drill 0.33, 0.41)
  Top 0.203: R10.2 30.12,60.45 C6.+ | R43.1 52.96,35.56 53.97,34.54 54.36,34.54 54.61,34.29 54.74,34.29 | 54.74,34.29 57.02,34.29 57.53,34.8 57.78,34.8 J11.2 | R37.2 57.87,44.89 D3.C 57.68,45.83 v56.39,47.12 | U1.5 22.54,50.99 C4.1 23.88,50.16 24.26,50.55 31.37,50.55 32.89,52.07 v33.27,52.07 | Q30.1(G) 58.86,26.61 58.04,27.43 58.04,28.19 57.78,28.45 56.13,28.45 55.5,27.81 54.48,27.81 53.97,28.32 53.97,29.57 Q31.1(G) 53.91,32.32 54.74,33.15 54.74,34.29 | Q11.1(G) 28.13,9.71 v27.18,8.89 | Q20.1(G) 31.81,9.71 v30.99,8.89 | Q21.1(G) 35.49,9.71 v34.67,8.89 | Q13.1(G) 8.06,9.71 v7.24,8.89 | Q25.1(G) 12.13,9.71 v11.3,8.89 | Q26.1(G) 16.06,9.71 v15.24,8.89
  Top 0.406: v55.12,57.53 53.72,58.93 45.09,58.93 41.53,55.37 33.15,55.37 v33.02,55.24 | U3.4 40.58,39.24 39.88,39.24 38.73,38.1 C13.1 v32,38.1 30.48,36.58 28.32,36.58 27.43,37.47 v14.6,37.47 | v60.83,37.85 60.83,43.43 60.2,44.07 v60.2,44.16 60.2,45.72 58.13,47.79 58.13,50.89 v58.29,51.05 | U3.18 51.98,47.24 C12.1 52.58,47.62 53.47,48.51 54.14,48.51 v54.23,48.6 | v15.37,25.4 J12.3
  Top 1.016: U2.3 33.02,59.84 C6.+ 30.48,62.38 J6.4
  Bottom 0.203: v56.39,47.12 56.77,47.12 57.24,46.65 L1.2 | v33.27,52.07 32.77,52.07
  Bottom 0.406: v32,38.1 32.77,38.86 32.77,52.07 32.77,54.99 v33.02,55.24 U2.3 | v55.12,57.53 57.02,55.63 57.66,55.63 58.29,54.99 v58.29,51.05 | J6.7 22.86,61.21 | v7.24,8.89 8.13,8.89 | 8.13,8.89 v11.3,8.89 v15.24,8.89 v27.18,8.89 v30.99,8.89 v34.67,8.89 | v60.83,37.85 60.83,37.47 58.93,35.56 J11.2 | v60.2,44.16 58.51,45.85 L1.2 L1.1 55.28,47.55 v54.23,48.6 | J13.3 13.27,42.35 14.6,41.02 v14.6,37.47 15.37,36.7 v15.37,25.4 | J12.3 10.03,24.77 10.03,24.26 9.27,23.5 9.27,22.35 8.13,21.21 8.13,8.89
  Bottom 0.813: J6.4 30.48,62.87 28.83,61.21 22.86,61.21 18.42,61.21 16.26,63.37 J7.4
_0V  (via drill 0.33)
  Top 0.203: U3.3 40.59,40.39 36.96,40.39 v36.83,40.26 | v33.53,28.07 33.78,27.81 39.5,27.81 41.02,26.29 44.58,26.29 44.83,26.04 46.99,26.04 47.62,26.67 47.62,26.92 48.01,27.3 51.82,27.3 54.23,24.89 54.99,24.89 v60.71,19.18
  Bottom 0.203: v60.71,19.18 60.96,19.18 J9.1 | v36.83,40.26 36.83,39.88 35.69,38.73 35.69,37.59 33.27,35.18 31.37,35.18 30.99,34.8 30.99,32.13 32.77,30.35 32.77,29.59 33.27,29.08 33.27,28.32 v33.53,28.07
_+5V  (via drill 0.33)
  Top 0.203: U3.6 43.61,40.01 44.32,40.01 45.21,39.12 45.21,38.1 45.97,37.34 45.97,36.32 v46.35,35.94 | v46.86,30.1 47.5,30.73 50.16,30.73 v50.67,30.23
  Bottom 0.203: J9.2 57.4,15.24 57.15,15.49 57.15,16 55.5,17.65 55.5,20.57 54.1,21.97 54.1,22.61 53.09,23.62 50.93,23.62 50.42,24.13 50.42,29.84 50.67,30.1 v50.67,30.23 | v46.35,35.94 46.61,35.69 46.61,30.35 v46.86,30.1
_IO14  (via drill 0.33)
  Top 0.203: J4.2 63.56,5.43 Q27.B Q27.E 63.31,7.55 v61.98,8.89 | v57.66,26.29 56.94,27.01 Q30.3(D)
  Bottom 0.203: v61.98,8.89 61.98,10.54 64.26,12.83 64.26,19.68 v57.66,26.29
_IO15  (via drill 0.33)
  Top 0.203: Q31.3(D) v54.86,28.7 | J4.4 56.77,2.67 58.08,3.98 Q28.E Q28.B 58.73,6.16 59.31,6.73 59.31,8.26 v59.94,8.89
  Bottom 0.203: v54.86,28.7 54.86,27.94 56.64,26.16 56.64,26.04 57.28,25.4 57.66,25.4 63.63,19.43 63.63,13.08 61.34,10.79 61.34,9.65 60.58,8.89 v59.94,8.89
ADC0  (via drill 0.33)
  Top 0.203: v56.52,54.1 56.39,54.23 50.67,54.23 50.42,53.98 45.85,53.98 45.47,53.59 v45.09,53.59 | C10.1 43.18,62.61 J5.1 | U3.23 46.19,47.12 45.72,47.12 45.21,47.62 45.21,48.64 45.09,48.77 v45.09,49.66 | v60.58,31.88 60.58,31.03 R28.1
  Bottom 0.203: v45.09,49.66 v45.09,53.59 45.09,53.72 45.85,54.48 45.85,61.47 44.45,62.87 44.45,63.25 44.2,63.5 J5.1 | v56.52,54.1 56.52,50.42 58.29,48.64 59.69,48.64 63.63,44.7 63.63,34.92 v60.58,31.88
ADC1  (via drill 0.33)
  Top 0.203: U3.24 45.97,48.62 45.97,49.4 v46.23,49.66 | v55.63,53.34 50.8,53.34 50.55,53.09 46.35,53.09 v46.23,52.96 | C11.1 46.35,62.87 J5.2 | v60.45,33.4 60.16,33.4 R29.1
  Bottom 0.203: v46.23,49.66 v46.23,52.96 46.48,53.21 46.48,62.74 J5.2 | v55.63,53.34 55.75,53.21 55.75,50.04 58.04,47.75 59.31,47.75 62.86,44.2 62.86,35.43 60.83,33.4 v60.45,33.4
ADC2  (via drill 0.33)
  Top 0.203: U3.25 42.81,49.67 | 42.81,49.67 41.04,51.44 35.69,51.44 34.16,49.91 33.53,49.91 32.13,48.51 30.1,48.51 28.07,46.48 26.54,46.48 26.16,46.1 v25.78,46.1 | v47.12,50.42 46.99,50.55 43.69,50.55 42.81,49.67 | J5.3 48.26,62.1 C8.1 | v24.26,34.16 24.51,33.91 26.92,33.91 27.81,33.02 29.97,33.02 31.88,31.11 32.38,31.11 32.51,30.99 35.05,30.99 v35.43,30.61 | v35.94,13.21 36.79,12.36 R23.2
  Bottom 0.203: v47.12,50.42 47.12,63.25 47.37,63.5 J5.3 | v25.78,46.1 25.78,42.16 24.26,40.64 v24.26,34.16 | v35.43,30.61 35.81,30.23 35.81,17.78 36.07,17.53 36.07,13.34 v35.94,13.21
ADC3  (via drill 0.33)
  Top 0.203: J5.4 50.8,61.98 C9.1 | v44.7,46.74 44.61,46.74 U3.26 40.55,50.8 36.07,50.8 34.54,49.28 33.78,49.28 32.38,47.88 30.35,47.88 28.19,45.72 26.8,45.72 26.04,44.96 26.04,43.56 24.38,41.91 20.83,41.91 v20.32,41.4 | v21.08,20.32 21.08,19.85 R26.2
  Bottom 0.203: J5.4 49.91,63.5 49.53,63.12 49.53,62.87 47.75,61.09 47.75,51.94 48.13,51.56 48.13,49.78 47.75,49.4 47.24,49.4 46.61,48.77 45.47,48.77 44.7,48.01 v44.7,46.74 | v20.32,41.4 20.32,21.08 v21.08,20.32
ADC6  (via drill 0.33)
  Top 0.203: U3.19 53.64,50.04 | 53.64,50.04 54.36,50.04 55.88,51.56 56.64,51.56 57.78,52.7 57.78,53.09 58.67,53.98 58.67,55.37 v59.44,56.13 | v53.59,55.12 53.34,54.86 50.42,54.86 49.53,55.75 48.77,55.75 48.26,55.24 44.58,55.24 42.93,53.59 35.05,53.59 34.42,52.96 32.89,52.96 31.11,51.18 26.8,51.18 25.87,52.11 R8.1 | 53.64,50.04 53.64,50.25 v53.59,50.29 | C5.1 56.22,61.05 57.78,62.61 57.78,62.87 J5.7
  Bottom 0.203: v59.44,56.13 59.56,56.26 59.56,61.21 58.42,62.36 J5.7 | v53.59,55.12 v53.59,50.29
ADC7  (via drill 0.33)
  Top 0.203: U3.22 49.02,48.81 v49.02,50.55 | v49.15,54.86 48.89,54.61 44.83,54.61 43.18,52.96 35.43,52.96 33.66,51.18 32.89,51.18 31.62,49.91 26.2,49.91 R6.2 22.35,48.39 21.72,49.02 R5.1 | J5.8 60.96,61.85 60.2,61.09 C3.1 59.18,61.09 v58.04,59.94
  Bottom 0.203: v49.02,50.55 49.02,51.82 48.39,52.45 48.39,54.86 | 48.39,54.86 48.39,60.71 49.78,62.1 51.31,62.1 51.94,61.47 57.02,61.47 58.04,60.45 v58.04,59.94 | v49.15,54.86 48.39,54.86
AREF
  Top 0.254: U3.20 51.18,48.71 C14.1
CS2_EN
  Top 0.203: Q32.C 38.73,18.29 39.37,17.65 40.64,17.65 40.77,17.78 42.29,17.78 42.67,17.4 42.67,16.51 41.91,15.75 41.91,14.61 41.4,14.1 41.4,13.68 R30.1
CS3_EN
  Top 0.203: R32.1 15.41,31.28 17.19,33.06 Q34.C
CS_ICP1_EN
  Top 0.203: R39.1 50.29,5.63 Q41.C
ESD_NODE  (via drill 0.33)
  Top 0.203: v61.34,4.45 60.58,5.21 Q28.C 60.28,5.29 61,6.01 Q27.C | v33.27,5.59 Q18.C | v29.59,5.59 Q17.C | v25.91,5.59 Q10.C | v5.84,5.59 Q12.C | v9.78,5.59 Q22.C | v13.72,5.59 Q23.C | v21.72,6.73 C7.1 23.11,7.87 23.75,8.51 R14.2
  Bottom 0.203: v5.84,5.59 v9.78,5.59 v13.72,5.59 15.24,5.59 15.87,6.22 17.65,6.22 18.29,5.59 21.72,5.59 | 21.72,5.59 v25.91,5.59 v29.59,5.59 v33.27,5.59 33.78,5.59 34.42,6.22 37.08,6.22 37.72,5.59 55.88,5.59 56.64,4.83 60.96,4.83 v61.34,4.45 | v21.72,6.73 21.72,5.59
IO2  (via drill 0.33)
  Top 0.203: R10.1 27.34,59.78 27.94,59.18 28.45,59.18 v28.96,58.67 | Q9.1(G) 26.23,53.02 v27.18,52.07 | U3.32 39.22,45.34 38.73,45.34 37.46,44.07 36.2,44.07 33.66,41.53 32.51,41.53 31.5,40.51 v30.99,40.51 29.85,39.37 v29.85,38.23 | v31.75,28.45 32,28.45 32.64,28.96 33.91,28.96 34.42,28.45 39.75,28.45 41.27,26.92 44.83,26.92 45.09,26.67 46.23,26.67 v46.48,26.92
  Bottom 0.203: v30.99,40.51 29.97,41.53 29.97,48.39 30.23,48.64 30.23,53.05 R11.1 R11.2 | R11.2 27.73,52.62 v27.18,52.07 | R11.2 27.81,53.68 27.81,53.98 28.57,54.74 28.83,54.74 29.68,55.59 R12.1 29.68,56.48 30.23,57.02 30.23,58.04 29.59,58.67 v28.96,58.67 | v29.85,38.23 29.08,37.47 29.08,30.61 29.59,30.1 29.59,29.97 30.61,28.96 31.24,28.96 v31.75,28.45 | v46.48,26.92 46.1,26.54 46.1,22.99 48.89,20.19 48.89,16.51 49.53,15.88 49.53,15.49 49.78,15.24 J9.5
IO3  (via drill 0.33)
  Top 0.203: 40.17,42.25 39.7,41.78 36.2,41.78 v34.42,40.01 | v31.88,29.59 32.13,29.72 34.16,29.72 34.8,29.08 40,29.08 41.53,27.56 45.34,27.56 45.59,27.81 v45.72,27.81 | R31.1 33.06,20.92 v34.04,19.94
  Top 0.254: U3.1 40.17,42.25
  Bottom 0.203: v34.42,40.01 34.42,38.1 32.77,36.45 30.1,36.45 29.72,36.07 29.72,30.99 30.35,30.35 30.35,30.1 30.86,29.59 v31.88,29.59 32.64,28.83 32.64,27.43 33.15,26.92 33.15,20.83 v34.04,19.94 | v45.72,27.81 45.47,27.56 45.47,22.73 48.26,19.94 J9.6
IO4  (via drill 0.33)
  Top 0.203: U3.2 40.22,41.15 36.45,41.15 35.69,40.39 35.69,40.01 v35.56,39.88 | v44.07,28.45 43.81,28.19 41.78,28.19 40.26,29.72 35.05,29.72 34.42,30.35 32.26,30.35 32.13,30.48 v31.24,30.48 29.85,31.88 27.69,31.88 27.05,31.24 R33.1
  Bottom 0.203: v44.07,28.45 43.31,28.45 43.18,28.32 43.18,19.56 43.43,19.3 43.43,17.02 44.32,16.13 44.83,16.13 J9.7 | v35.56,39.88 35.56,39.62 35.05,39.12 35.05,37.85 33.02,35.81 30.61,35.81 30.35,35.56 30.35,31.37 v31.24,30.48
IO5  (via drill 0.33)
  Top 0.203: U3.9 46.99,37.57 v46.99,36.83 | v42.8,29.72 43.05,29.97 45.72,29.97 46.48,29.21 v47.5,29.21 48.26,29.97 49.28,29.97 49.66,29.59 R20.2
  Bottom 0.203: v46.99,36.83 47.24,36.58 47.24,30.99 47.75,30.48 47.75,29.46 v47.5,29.21 | J9.8 43.18,16.26 42.8,16.64 42.8,19.05 42.54,19.3 42.54,29.46 v42.8,29.72
IO6  (via drill 0.33)
  Top 0.203: U3.10 48.13,37.56 v48.13,36.96 | v48.13,28.19 48.01,28.32 47.12,28.32 46.86,28.57 46.23,28.57 45.47,29.34 43.69,29.34 43.18,28.83 42.42,28.83 41.66,29.59 41.66,29.84 41.15,30.35 v40.89,30.35 | v55.12,16.64 57.15,18.67 R36.2
  Bottom 0.203: J9.9 40.64,16.51 40.39,16.76 40.39,18.29 41.02,18.92 41.02,19.05 41.27,19.3 41.27,30.1 v40.89,30.35 | v48.13,36.96 48.13,36.45 47.88,36.2 47.88,31.37 48.51,30.73 48.51,28.57 v48.13,28.19 48.13,26.92 48.01,26.8 48.01,26.04 48.64,25.4 48.64,25.02 50.67,22.99 52.83,22.99 53.47,22.35 53.47,21.72 54.86,20.32 54.86,16.89 v55.12,16.64
IO7  (via drill 0.33)
  Top 0.203: U3.11 49.28,37.55 v49.28,37.08 | v41.15,31.88 42.29,31.88 42.93,31.24 45.85,31.24 47.12,32.51 48.39,32.51 v48.77,32.89 | R42.1 50.33,18.76 49.15,19.94 40.77,19.94 v40,19.18
  Bottom 0.203: v49.28,37.08 49.28,36.7 48.51,35.94 48.51,33.15 v48.77,32.89 | 40.26,19.18 40.64,19.56 40.64,29.34 40,29.97 40,30.73 v41.15,31.88 | v40,19.18 40.26,19.18 | 40.26,19.18 39.62,18.54 39.62,16.76 J9.10
IO8  (via drill 0.33)
  Top 0.203: U3.12 50.29,37.66 v50.29,37.47 50.71,37.05 R43.2 | v48.77,31.75 48.51,31.75 48.39,31.88 47.37,31.88 46.1,30.61 42.67,30.61 42.29,30.99 v41.91,30.99 | R41.2 44.36,18.67 v41.91,18.67 40.77,18.67 40.39,18.29 39.62,18.29 38.73,19.18 36.7,19.18 35.81,18.29 34.04,18.29 v33.91,18.16
  Bottom 0.203: v41.91,30.99 v41.91,18.67 | v50.29,37.47 50.29,36.83 49.15,35.69 49.15,33.78 49.66,33.27 49.66,32.51 49.15,32 49.02,32 v48.77,31.75 | v33.91,18.16 34.04,18.03 J10.10
IO9  (via drill 0.33)
  Top 0.203: U3.13 51.56,37.52 v51.56,37.08 | Q3.1(G) 13.65,48.45 v13.84,48.64 | v48.89,26.42 48.26,26.42 47.24,25.4 44.58,25.4 44.32,25.65 40.77,25.65 39.24,27.18 30.23,27.18 v30.1,27.3 29.85,27.3 29.08,26.54 19.9,26.54 19.41,26.05 | R3.1 19.27,25.91 19.41,26.05 | v17.4,26.42 19.05,26.42 19.41,26.05
  Bottom 0.203: v51.56,37.08 49.78,35.31 49.78,34.04 50.29,33.53 50.29,32.26 49.66,31.62 49.66,31.37 49.15,30.86 49.15,26.67 v48.89,26.42 | J10.9 31.5,26.29 30.48,27.3 v30.1,27.3 | v13.84,48.64 13.84,45.09 16.38,42.55 16.38,38.48 16.89,37.97 17.02,37.97 17.14,37.85 17.14,26.54 v17.4,26.42
IO10_
  Top 0.203: Q11.3(D) 27.18,6.73 26.86,6.41 Q10.E Q10.B 24.96,4.51 23.11,2.67 J2.5
IO11_
  Top 0.203: Q20.3(D) 30.86,6.73 30.54,6.41 Q17.E Q17.B 28.64,4.51 26.8,2.67 J2.4
IO12_
  Top 0.203: Q25.3(D) 11.18,6.6 10.73,6.16 Q22.E Q22.B 8.42,4.49 6.6,2.67 J1.4
IO13_
  Top 0.203: Q13.3(D) 7.11,6.48 6.79,6.16 Q12.E Q12.B 4.58,4.62 J1.5
IO16_
  Top 0.203: Q21.3(D) 34.54,6.73 34.22,6.41 Q18.E Q18.B 32.32,4.51 30.48,2.67 J2.3
IO17_
  Top 0.203: Q26.3(D) 15.11,6.73 14.67,6.28 Q23.E Q23.B 12.49,4.62 10.54,2.67 J1.3
MISO  (via drill 0.33)
  Top 0.203: U3.16 54.1,38.38 54.1,37.21 55.75,35.56 J11.1 | v52.2,24.51 51.94,24.26 51.43,24.26 50.42,23.24 48.77,23.24 48.39,22.86 43.56,22.86 43.31,23.11 39.62,23.11 38.1,24.64 31.88,24.64 31.24,24 29.46,24 28.83,24.64 27.43,24.64 26.92,24.13 24.77,24.13 24.38,24.51 v24.26,24.51 24.13,24.64 23.62,24.64 22.99,25.27 21.97,25.27 21.46,24.77 21.46,22.1 20.7,21.34 20.45,21.34 19.94,20.83 R25.2
  Bottom 0.203: J10.6 24.89,15.24 25.15,15.49 25.15,16.51 25.53,16.89 25.53,22.48 24.26,23.75 v24.26,24.51 | J11.1 54.99,34.54 53.21,34.54 52.83,34.16 52.83,29.21 52.45,28.83 52.45,27.56 52.83,27.18 52.83,25.65 52.2,25.02 v52.2,24.51
MOSI  (via drill 0.33)
  Top 0.203: U3.15 53.47,37.88 53.47,36.83 54.36,35.94 v54.36,35.56 | v51.31,25.27 51.31,25.02 50.16,23.88 48.51,23.88 48.13,23.5 43.81,23.5 43.56,23.75 39.88,23.75 38.35,25.27 31.62,25.27 30.99,24.64 29.72,24.64 29.08,25.27 25.53,25.27 v25.27,25.02 | v29.97,13.21 30.61,13.21 30.86,12.95 30.86,12.36 R22.2
  Bottom 0.203: v25.27,25.02 25.27,23.75 26.16,22.86 26.16,16.51 26.42,16.26 J10.7 26.42,13.46 27.18,12.7 29.46,12.7 v29.97,13.21 | J11.4 58.29,38.1 57.02,36.83 54.99,36.83 54.36,36.2 v54.36,35.56 53.34,35.56 52.2,34.42 52.2,29.46 51.82,29.08 51.82,27.3 52.2,26.92 52.2,25.91 51.56,25.27 v51.31,25.27
N$1
  Top 0.203: R25.1 17.31,20.92 16.13,22.1 14.35,22.1 12.57,20.32 12.57,19.18 11.81,18.41 7.75,18.41 6.86,17.53 6.86,11.56 7.37,11.05 8.91,11.05 Q25.2(S)
N$2
  Top 0.203: R9.2 39.33,60.59 Q8.1(G) 40.05,59.77 41.15,58.67 41.15,57.53 40.51,56.9 37.85,56.9 37.72,56.77 31.33,56.77 30.1,55.54 R13.1
N$3
  Top 0.203: R17.1 14.1,22.73 11.94,20.57 11.94,19.43 11.56,19.05 7.37,19.05 6.16,17.72 Q13.2(S)
N$4
  Top 0.203: R13.2 30.1,53.34 27.86,55.58 Q9.3(D)
N$5
  Top 0.203: R16.2 22.39,44.49 22.1,44.2 20.96,44.2 20.32,43.69 19.52,43.69 Q7.C
  Top 0.61: Q5.B 18.69,42.74 Q7.C
N$6
  Top 0.203: Q7.E 14.16,41.85 13.72,42.29 13.72,45.09 14.1,45.47 16.43,45.47 Q6.C | R4.2 21.34,47.23 Q6.B 19.24,45.28 18.29,46.23 Q6.C | Q4.1(G) 14.79,52.14 16,50.93 16,48.26 16.76,47.5 16.76,46.65 Q6.C
N$7
  Top 0.203: Q5.C 12.62,44.24 13.08,44.7 13.08,45.34 13.72,45.97 13.72,47.24 13.46,47.5 12.06,47.5 11.43,48.13 11.43,48.39 D2.A
N$8
  Top 0.203: U1.1 24.19,54.39 R8.2
N$9
  Top 0.203: R24.1 21.72,8.38 20.7,7.37 20.7,5.21 20.32,4.83 19.07,4.83 Q24.E
  Top 0.61: Q24.E Q35.B
N$10
  Top 0.203: R4.1 20.99,45.38 20.07,44.45 17.25,44.45 Q7.B
  Top 0.61: Q5.E 15.66,44.64 Q7.B
N$11  (via drill 0.33)
  Top 0.203: R32.2 17.78,30.99 v18.67,30.1 | v15.62,17.65 15.62,16.51 14.99,15.88 14.99,14.73 16.38,13.34 17.02,13.34 18.92,11.43 Q35.C
  Top 0.61: Q35.C 18.92,6.88 Q24.B
  Bottom 0.203: v18.67,30.1 19.05,29.72 19.05,25.4 16.76,23.11 16.76,18.8 v15.62,17.65
N$12
  Top 0.203: R26.1 16.89,18.92 16.38,19.43 15.11,19.43 12.83,17.14 9.53,17.14 8.89,16.51 8.89,13.72 9.65,12.95 12.19,12.95 14.16,10.98 Q26.2(S)
N$13
  Top 1.016: D1.A 10.57,61.12 11.05,61.59 11.05,63.36 J7.3
N$15
  Top 0.203: R29.2 56.93,32.3 56.77,32.26 56.26,32.26 55.88,31.88 55.88,29.7 Q31.2(S)
N$16
  Top 0.203: Q30.2(S) 59.14,29.16 R28.2
N$18
  Top 0.203: R42.2 52.07,14.35 51.56,13.84 51.56,10.3 Q41.B
N$19
  Top 0.203: Q38.C 60.49,12.32 R35.1
N$20
  Top 0.203: R18.1 64.28,11.52 Q15.B
  Top 0.61: Q14.E Q15.B
N$21
  Top 0.203: R19.1 66.64,15.84 64.64,13.84 64.22,13.84 Q16.C
N$22
  Top 0.203: Q16.B 65.08,16.96 62.48,19.56 61.59,19.56 61.09,20.07 60.71,20.07 55.12,25.65 54.36,25.65 52.03,27.98 52.03,28.83 R20.1
N$23
  Top 0.203: Q15.C 66.67,12.83 66.93,13.08 R19.2
  Top 0.254: 67.56,8.4 Q14.B 67.62,8.32
  Top 0.61: 67.62,8.32 66.67,9.27 Q15.C
N$25
  Top 0.203: Q38.B 56.32,11.37 55.88,11.81 55.88,12.83 56.26,13.21 56.26,13.72 57.15,14.61 R36.1
N$26
  Top 0.203: R31.2 35.01,19.32 Q32.B
N$28
  Top 0.203: R27.1 54.48,10.54 55.18,9.84 Q39.B
  Top 0.61: Q29.E 54.23,6.6 55.18,7.56 Q39.B
N$29
  Top 0.203: Q39.C 56.85,10.24 57.15,10.54 59.94,10.54 60.24,10.83 R35.2
  Top 0.61: Q39.C 56.13,6.62 Q29.B
N$30
  Top 0.203: Q34.B 19.4,32.7 R33.2
N$32
  Top 0.203: D1.K 15.11,60.45 16.22,61.56 R1.2
  Top 1.016: Q2.2(S) 13.51,57.59 Q1.E 13.53,57.72 14.22,58.42 14.22,58.67 14.57,59.02 D1.K
N$33
  Top 0.203: R2.2 12.49,50.97 12.57,51.05 12.57,54.36 12.19,54.74 12.19,55.52 Q2.1(G) | Q2.1(G) 12.02,56.3 11.94,56.39 | Q2.1(G) 13.65,55.69 13.84,55.5 14.31,55.5 Q1.C 14.6,55.54 14.6,56.01 15.43,56.83 Q1.B 15.43,57.85 17.14,59.56 R1.1
N$34
  Top 0.203: Q3.3(D) 14.82,47.71 15.11,48.01 15.11,49.62 R2.1
N$35
  Top 0.203: J12.6 11.94,34.29 C17.2
N$91
  Top 0.203: 37.53,6.41 37.53,6.16 38.48,5.21 39.88,5.21 40.39,5.71 40.39,7.02 R21.1
  Top 0.61: Q19.E 37.53,6.41 37.21,6.73 37.21,7.6 Q33.B
N$93
  Top 0.203: R22.1 32.85,12.03 31.62,10.79 31.24,10.79 30.73,10.29 30.46,10.29 Q20.2(S)
N$97
  Top 0.203: Q33.C 39.33,9.86 40.81,11.34 R30.2
  Top 0.406: Q19.B 39.03,6.31 38.23,7.11 38.23,7.24
  Top 0.61: 38.23,7.24 Q33.C
N$104
  Top 0.203: R15.1 28.41,11.92 Q11.2(S)
N$107
  Top 0.203: R40.2 44.58,9.53 45.05,9.99 45.05,10.36 Q40.B
N$108
  Top 0.203: Q40.C 42.97,12.49 44.45,13.97 R41.1
N$110
  Top 0.203: R23.1 34.84,10.98 Q21.2(S)
N$114
  Top 0.203: Q37.B 47.31,12.42
  Top 0.254: 47.31,12.42 R34.1
  Top 0.61: Q36.E Q37.B
N$115
  Top 0.203: U3.7 40.67,35.94 38.61,35.94 37.21,34.54 Y1.1 34.46,32.77 C15.2
N$116
  Top 0.203: U3.8 42.67,36.81 42.67,36.58 42.8,36.45 43.43,36.45 43.69,36.2 43.69,35.94 43.43,35.69 42.04,35.69 41.74,35.39 Y1.2 43.26,33.02 C16.2
N$119
  Top 0.203: Q36.B 49.21,5.65 49.02,5.46 49.02,3.72 R39.2
  Top 0.61: Q37.C 48.26,7.89 Q36.B
PL
  Top 0.203: J3.2 43.49,4.29 R38.2 44.03,5.17 44.58,5.71 R40.1
POWER
  Top 1.016: Q4.3(D) 11.47,53.42 10.41,54.48 10.41,56.05 Q2.3(D) 6.48,59.99 6.48,60.58 4.06,62.99 J7.1
RX  (via drill 0.33)
  Top 0.203: U3.30 39.96,46.86 38.48,46.86 36.96,45.34 35.69,45.34 33.4,43.05 32.26,43.05 31.24,42.04 30.35,42.04 28.19,39.88 28.19,39.5 v27.81,39.12 | J12.4 27.18,27.94 v27.56,28.32 | v28.19,22.61 28.96,22.61 29.08,22.73 31.75,22.73 32.38,23.37 37.59,23.37 39.12,21.84 42.8,21.84 43.05,21.59 50.42,21.59 50.8,21.21 51.82,21.21 v52.58,21.97
  Bottom 0.203: v52.58,21.97 52.58,21.59 54.23,20.07 54.23,16.26 54.61,15.88 54.61,15.37 54.74,15.24 J9.3 | v27.81,39.12 27.81,28.57 v27.56,28.32 27.43,28.19 27.43,23.5 28.19,22.73 v28.19,22.61
SCK  (via drill 0.33)
  Top 0.203: U3.17 50.55,44.04 51.05,43.69 51.56,43.69 54.61,40.64 54.61,40.13 55.37,39.37 55.37,38.73 J11.3 | v51.31,26.42 50.93,26.42 50.42,25.91 50.42,25.02 49.91,24.51 48.13,24.51 47.75,24.13 44.07,24.13 43.81,24.38 40.26,24.38 38.73,25.91 31.37,25.91 30.73,25.27 29.97,25.27 29.34,25.91 24.89,25.91 24.64,25.65 v24,25.65 23.75,25.91 20.96,25.91 20.57,25.53 20.57,24.13 20.28,23.84 R17.2
  Bottom 0.203: J11.3 54.86,38.1 51.56,34.8 51.56,29.72 51.18,29.34 51.18,26.54 v51.31,26.42 | J10.5 22.35,15.24 22.61,15.49 22.61,16.26 22.99,16.64 24.26,16.64 24.89,17.27 24.89,22.23 23.62,23.5 23.62,23.88 23.37,24.13 23.37,25.02 v24,25.65
SCL
  Top 0.203: U3.28 40.95,48.13 39.12,48.13 38.35,48.9 36.83,48.9 35.31,47.37 34.67,47.37 33.15,45.85 31.24,45.85 25.27,39.88 23.62,39.88 22.99,39.24 11.18,39.24 10.41,38.48 J13.1
  Bottom 0.203: J13.1 10.79,37.97 11.94,37.97 12.45,37.47 12.45,35.94 13.08,35.31 13.08,19.3 12.45,18.67 12.45,15.49 12.19,15.24 J10.1
SDA
  Top 0.203: J13.2 10.89,39.88 22.73,39.88 23.37,40.51 25.02,40.51 30.99,46.48 32.89,46.48 34.42,48.01 35.05,48.01 36.58,49.53 38.86,49.53 39.62,48.77 41.45,48.77 U3.27
  Bottom 0.203: J10.2 13.21,15.75 13.21,18.29 13.72,18.8 13.72,35.56 13.08,36.2 13.08,39.12 11.81,40.39 10.45,40.39 J13.2
SHLD_VIN
  Top 1.016: Q8.3(D) 42.25,59.99 40.89,61.34 40.89,62.36 39.75,63.5 J6.1
TX  (via drill 0.33)
  Top 0.203: U3.31 39.59,46.1 38.61,46.1 37.21,44.7 35.94,44.7 33.53,42.29 32.38,42.29 31.5,41.4 30.61,41.4 28.96,39.75 v28.96,38.99 | v28.45,23.75 28.83,23.75 29.21,23.37 31.5,23.37 32.13,24 37.85,24 39.37,22.48 43.05,22.48 43.31,22.23 51.05,22.23 v51.18,22.1 | J12.5 10.67,29.34 10.79,29.21 11.3,29.21 11.94,28.57 26.54,28.57 27.18,29.21 v28.7,29.21
  Bottom 0.203: J9.4 53.34,16.13 53.59,16.51 53.59,19.68 v51.18,22.1 | v28.96,38.99 28.96,38.73 28.45,38.23 28.45,29.21 | v28.7,29.21 28.45,29.21 | 28.45,29.21 28.45,27.94 28.07,27.56 28.07,24.13 v28.45,23.75
VIN  (via drill 0.33, 0.41)
  Top 0.203: R9.1 37.38,60.16 U2.1 | Q37.E 49.21,10.6 v49.4,10.79 49.21,10.92 49.21,12.42 49.24,12.45 R34.2 | Q39.E 57.08,8.82 v57.53,9.27 | 67.62,10.23 67.62,11.24 v67.82,11.43 | U1.4 19.91,51.79 v19.69,51.56 | v23.37,58.93 23.24,58.8 22.48,58.8 22.1,58.55 22.1,58.16 R7.1 | R18.2 64.35,9.56 64.9,9.02 64.9,7.11 v65.28,6.73 | v53.21,11.81 53.21,12.32 53.68,12.79 R27.2 | v42.16,10.29 41.7,10.29 R21.2 39.18,7.77 Q33.E | R24.2 21.72,10.79 v20.7,11.81 | R14.1 22.73,11.39 R24.2 | Q35.E 19.87,8.53 R24.2
  Top 0.254: Q15.E 67.62,10.23
  Top 0.406: v24.38,56.77 24.38,57.15
  Top 1.016: U2.1 38.1,58.67 37.97,58.55 | 37.97,58.55 37.21,57.78 30.86,57.78 29.85,56.77 28.07,56.77 27.69,57.15 24.38,57.15 22.99,57.15 22.35,57.78 R7.1 | Q8.2(S) 37.97,57.98 37.97,58.55
  Bottom 0.203: v49.4,10.79 49.4,10.54 | v57.53,9.27 56.52,8.26 | v67.82,11.43 67.82,7.75 66.8,6.73 v65.28,6.73 | v19.69,51.56 19.69,56.52 22.1,58.93 v23.37,58.93 | v53.21,11.81 53.21,10.54 | v42.16,10.29 42.16,10.54 | v20.7,11.81 20.07,11.81
  Bottom 0.305: 20.07,16 20.07,14.61
  Bottom 0.406: v65.28,6.73 58.04,6.73 56.52,8.26 54.23,10.54 53.21,10.54 49.4,10.54 42.16,10.54 20.96,10.54 20.07,11.43 20.07,11.81 20.07,14.61 | v24.38,56.77 24.38,47.24 21.84,44.7 21.84,42.8 22.1,42.55 22.1,40.51 21.84,40.26 21.84,22.35 23.24,20.95 23.24,19.3 21.97,18.03 21.08,18.03 20.07,17.02 20.07,16
VIN_S
  Top 0.203: U1.3 20.04,54.39 19.47,54.95 C2.1 17.27,53.43 17.27,50.04 18.2,49.11 R5.2 19.39,47.83 Q6.E
  Top 0.305: C2.1 18.8,55.75 18.92,55.88 R7.2
  Top 1.016: C1.1 19.56,59.44 18.92,58.8 R7.2 18.03,57.78 16.76,56.52 16.76,55.5 15.11,53.85 13.84,53.85 13.67,54.02 Q4.2(S)

### Text on the board
tPlace: RPUno | RPUBUS.ORG
bPlace: NC | IOREF | nRST | NC | 5V | 0V | 0V | ADC0 14 | ADC1 15 | ADC2 16 | ADC3 17 | NC | NC | ADC6 | ADC7 | 0V | NC | VIN | PWR / 7..36V | 0V | ALT | 5V | 9_EN | SHIELD VIN IS / CNTRLD BY D2 (IO2) | 0V | SPI | 5V | 0V | SDA | I2C | !RESET | MOSI | SCL | SCK | IOREF | MISO | BOOTLOAD / PORT | !DTR! OR !RTS! | HOST_RX < TX | HOST_TX > RX | +5V | NC | 0V | CS_ICP1_EN | SHLD_VIN_EN | NC | SCK | MISO | MOSI | !SS | ALT_EN | ICP1 | CS1_EN | CS0_EN | CS3_EN | CS2_EN | +5V | 0V | SDA | 0V | 12 | 11 | 10 | 9 | 8 | 7 | 6 | 5 | 4 | 3 | 2 | TX | RX | SCL | 13 | 14140^9 | 17 | 14 | RPUno | RPUBUS.ORG | 4_EN | 16 | 3_EN | ICP1 | 7_EN | 6_EN | 15 | 5_EN | 13 | 12 | ADC3 | 10 | 11 | 0V | 22mA | 0V | ADC2 | 22mA | 0V | PL1 | 17mA | 22mA | ADC1 | ADC0 | 22mA